# Altium schematic sheet Kill Switch.SchDoc
size Letter
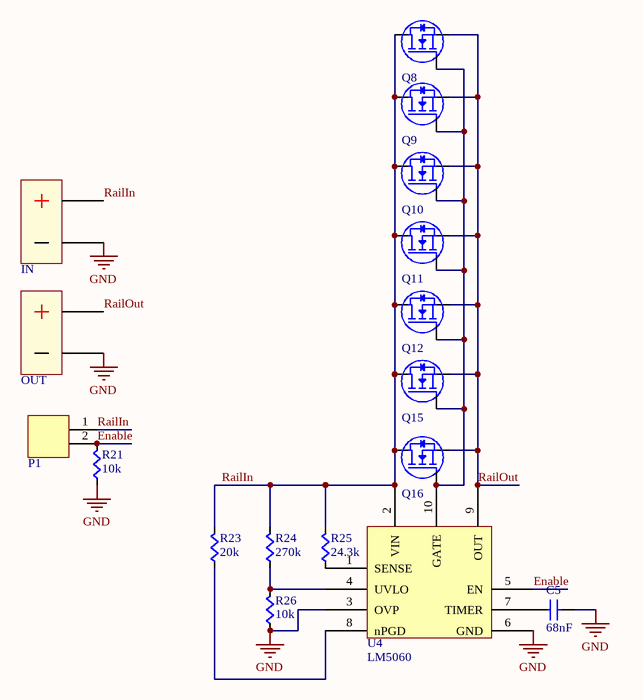
[diagram p0: Kill Switch.SchDoc]

## Parts
C5  value 68nF  [CAPC0603]  (hidden comment: Cap)
IN  BATWIRE  [BATWIRE12]  (value not drawn)
OUT  BATWIRE  [BATWIRE12]  (value not drawn)
P1  2-pin Vert Sherlock  [MOLEX-HDR-1X2-SHERLOCK-VERT]  (value not drawn)
Q8  CSD19502Q5B  [CSD19502Q5B]  (value not drawn)
Q9  CSD19502Q5B  [CSD19502Q5B]  (value not drawn)
Q10  CSD19502Q5B  [CSD19502Q5B]  (value not drawn)
Q11  CSD19502Q5B  [CSD19502Q5B]  (value not drawn)
Q12  CSD19502Q5B  [CSD19502Q5B]  (value not drawn)
Q15  CSD19502Q5B  [CSD19502Q5B]  (value not drawn)
Q16  CSD19502Q5B  [CSD19502Q5B]  (value not drawn)
R21  value 10k  [RES0603]  (hidden comment: Res)
R23  value 20k  [RES0603]  (hidden comment: Res)
R24  value 270k  [RES0603]  (hidden comment: Res)
R25  value 24.3k  [RES0603]  (hidden comment: Res)
R26  value 10k  [RES0603]  (hidden comment: Res)
U4  LM5060  [LM5060]

## Nets
GND: C5.2(B) IN.- OUT.- R21.2(B) R26.2(B) U4.3(OVP) U4.6(GND)
Enable: P1.2 R21.1(A) U4.5(EN)
RailIn: IN.+ P1.1 Q8.D Q9.D Q10.D Q11.D Q12.D Q15.D Q16.D R23.1(A) R24.1(A) R25.1(A) U4.2(VIN)
RailOut: OUT.+ Q8.S Q9.S Q10.S Q11.S Q12.S Q15.S Q16.S U4.9(OUT)
NetC5_1: C5.1(A) U4.7(TIMER)
NetQ8_G: Q8.G Q9.G Q10.G Q11.G Q12.G Q15.G Q16.G U4.10(GATE)
NetR23_2: R23.2(B) U4.8(nPGD)
NetR24_2: R24.2(B) R26.1(A) U4.4(UVLO)
NetR25_2: R25.2(B) U4.1(SENSE)

## Library data of the parts
IN OUT = BATWIRE: Two large gauge leads soldered directly to the board.
P1 = MOLEX-HDR-1x2-SHERLOCK_VERT: Header, Molex, 2mm Pitch Sherlock Header, Single Row, Vertical, 2 Circuits, Length 3.3mm, 0353620250; Manufacturer Part Number: *; Order Part Number: *
Q8-Q12 Q15 Q16 = CSD19502Q5B: NEXFET Power MOSFET; Supplier 1: Digi-Key; Supplier Part Number 1: 296-37194-1-ND
U4 = LM5060: Hotswap Controller; Supplier 1: Digi-Key; Supplier Part Number 1: LM5060Q1MM/NOPBCT-ND
C5 = Cap: Supplier 1: Digi-Key; Supplier Part Number 1: 1276-2112-1-ND
R21 R23-R26 = Res: Supplier 1: Digi-Key
  R21: Supplier Part Number 1: RMCF0603JT10K0CT-ND
  R23: Supplier Part Number 1: RHM20KDCT-ND
  R24: Supplier Part Number 1: RHM270KCFCT-ND
  R26: Supplier Part Number 1: RMCF0603FT10K0CT-ND